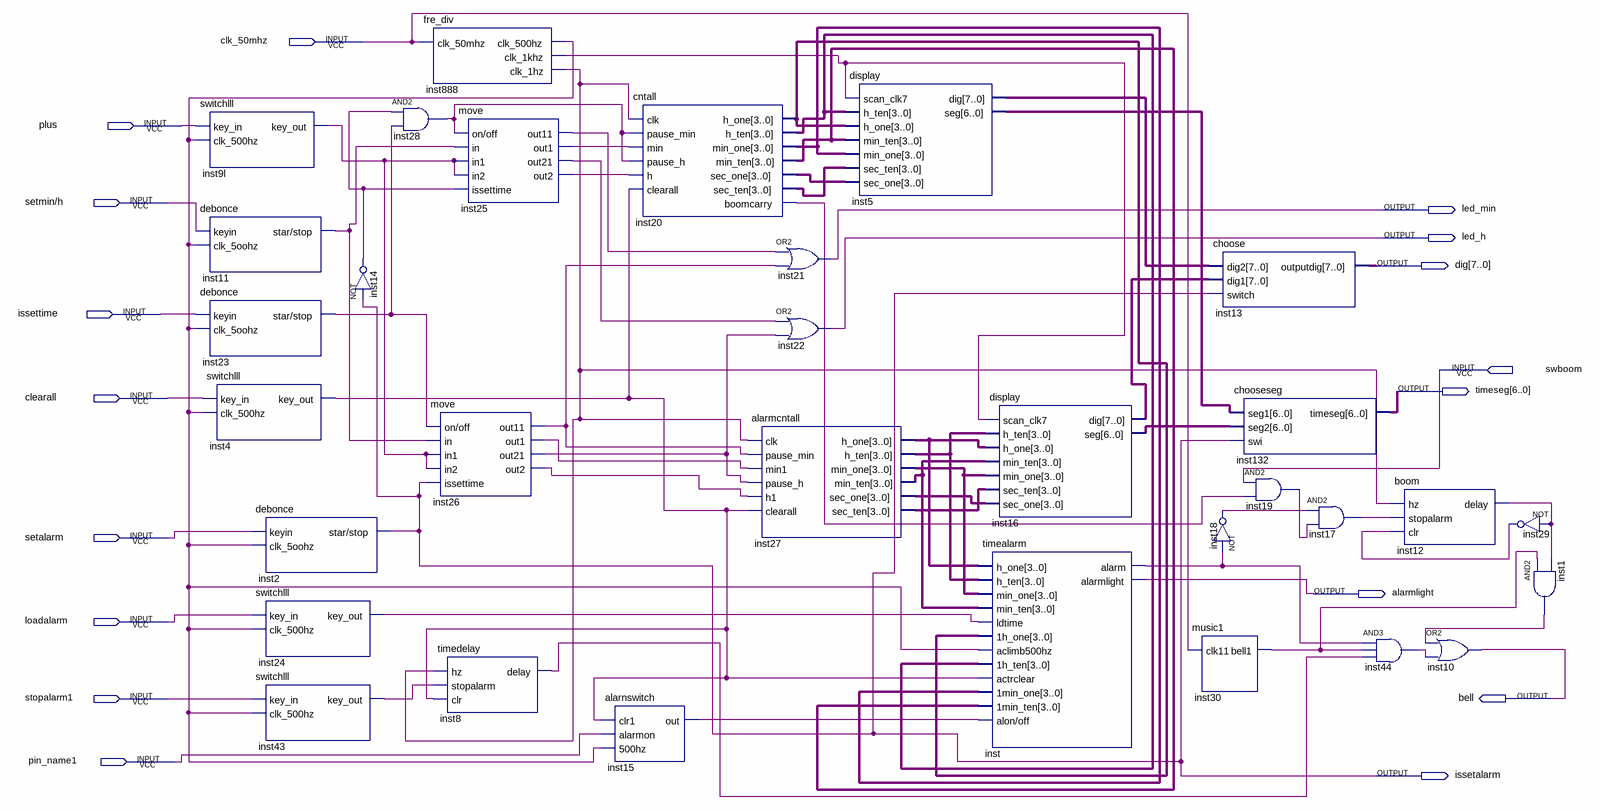
[diagram p0: schematic sheet]
// Quartus schematic clock.bdf as structural Verilog: 32 symbols, 17 pins
module clock (
  input  clk_50mhz,
  input  plus,
  input  \setmin/h ,
  input  issettime,
  input  swboom,
  input  clearall,
  input  setalarm,
  input  loadalarm,
  input  stopalarm1,
  input  pin_name1,
  output led_min,
  output led_h,
  output [7:0] dig,
  output [6:0] timeseg,
  output alarmlight,
  output bell,
  output issetalarm
);

  wire inst1_out, inst4_key_out, inst8_delay, inst9l_key_out, inst11_star_stop, inst12_delay, inst14_out,
       inst15_out, inst17_out, inst18_out, inst19_out, inst20_boomcarry, inst23_star_stop, inst24_key_out,
       inst25_out1, inst25_out2, inst25_out11, inst25_out21, inst26_out1, inst26_out2, inst26_out11,
       inst26_out21, inst28_out, inst29_out, inst30_bell1, inst43_key_out, inst44_out, inst888_clk_1hz,
       inst888_clk_1khz, inst888_clk_500hz, inst_alarm;
  wire [3:0] inst20_h_one, inst20_h_ten, inst20_min_one, inst20_min_ten, inst20_sec_one, inst20_sec_ten,
       inst27_h_one, inst27_h_ten, inst27_min_one, inst27_min_ten, inst27_sec_one, inst27_sec_ten;
  wire [6:0] inst5_seg, inst16_seg;
  wire [7:0] inst5_dig, inst16_dig;

  switchlll inst9l (.key_in(plus), .clk_500hz(inst888_clk_500hz), .key_out(inst9l_key_out));
  debonce inst11 (.keyin(\setmin/h ), .clk_5oohz(inst888_clk_500hz), .\star/stop (inst11_star_stop));
  debonce inst23 (.keyin(issettime), .clk_5oohz(inst888_clk_500hz), .\star/stop (inst23_star_stop));
  switchlll inst4 (.key_in(clearall), .clk_500hz(inst888_clk_500hz), .key_out(inst4_key_out));
  debonce inst2 (.keyin(setalarm), .clk_5oohz(inst888_clk_500hz), .\star/stop (issetalarm));
  switchlll inst24 (.key_in(loadalarm), .clk_500hz(inst888_clk_500hz), .key_out(inst24_key_out));
  switchlll inst43 (.key_in(stopalarm1), .clk_500hz(inst888_clk_500hz), .key_out(inst43_key_out));
  not inst14 (inst14_out, issetalarm);
  and inst28 (inst28_out, inst14_out, inst23_star_stop);
  fre_div inst888 (
    .clk_50mhz(clk_50mhz), .clk_500hz(inst888_clk_500hz), .clk_1khz(inst888_clk_1khz),
    .clk_1hz(inst888_clk_1hz));
  move inst25 (
    .\on/off (inst28_out), .in(inst11_star_stop), .in1(inst9l_key_out), .in2(inst9l_key_out),
    .issettime(inst14_out), .out11(inst25_out11), .out1(inst25_out1), .out21(inst25_out21), .out2(inst25_out2));
  move inst26 (
    .\on/off (inst23_star_stop), .in(inst11_star_stop), .in1(inst9l_key_out), .in2(inst9l_key_out),
    .issettime(issetalarm), .out11(inst26_out11), .out1(inst26_out1), .out21(inst26_out21), .out2(inst26_out2));
  timedelay inst8 (.hz(inst888_clk_1hz), .stopalarm(inst43_key_out), .clr(inst4_key_out), .delay(inst8_delay));
  cntall inst20 (
    .clk(inst888_clk_1hz), .pause_min(inst28_out), .min(inst25_out1), .pause_h(inst28_out), .h(inst25_out2),
    .clearall(inst4_key_out), .h_one(inst20_h_one), .h_ten(inst20_h_ten), .min_one(inst20_min_one),
    .min_ten(inst20_min_ten), .sec_one(inst20_sec_one), .sec_ten(inst20_sec_ten), .boomcarry(inst20_boomcarry));
  alarnswitch inst15 (.clr1(inst4_key_out), .alarmon(pin_name1), .\500hz (inst888_clk_500hz), .out(inst15_out));
  alarmcntall inst27 (
    .clk(inst888_clk_1hz), .pause_min(inst26_out11), .min1(inst26_out1), .pause_h(inst26_out21),
    .h1(inst26_out2), .clearall(inst4_key_out), .h_one(inst27_h_one), .h_ten(inst27_h_ten),
    .min_one(inst27_min_one), .min_ten(inst27_min_ten), .sec_one(inst27_sec_one), .sec_ten(inst27_sec_ten));
  or inst21 (led_min, inst25_out11, inst26_out11);
  or inst22 (led_h, inst25_out21, inst26_out21);
  display inst5 (
    .scan_clk7(inst888_clk_1khz), .h_ten(inst20_h_ten), .h_one(inst20_h_one), .min_ten(inst20_min_ten),
    .min_one(inst20_min_one), .sec_ten(inst20_sec_ten), .sec_one(inst20_sec_one), .dig(inst5_dig),
    .seg(inst5_seg));
  display inst16 (
    .scan_clk7(inst888_clk_1khz), .h_ten(inst27_h_ten), .h_one(inst27_h_one), .min_ten(inst27_min_ten),
    .min_one(inst27_min_one), .sec_ten(inst27_sec_ten), .sec_one(inst27_sec_one), .dig(inst16_dig),
    .seg(inst16_seg));
  timealarm inst (
    .h_one(inst27_h_one), .h_ten(inst27_h_ten), .min_one(inst27_min_one), .min_ten(inst27_min_ten),
    .ldtime(inst24_key_out), .\1h_one (inst20_h_one), .aclimb500hz(inst888_clk_500hz),
    .\1h_ten (inst20_h_ten), .actrclear(inst4_key_out), .\1min_one (inst20_min_one),
    .\1min_ten (inst20_min_ten), .\alon/off (inst15_out), .alarm(inst_alarm), .alarmlight(alarmlight));
  music1 inst30 (.clk11(clk_50mhz), .bell1(inst30_bell1));
  choose inst13 (.dig2(inst5_dig), .dig1(inst16_dig), .switch(issetalarm), .outputdig(dig));
  chooseseg inst132 (.seg1(inst5_seg), .seg2(inst16_seg), .swi(issetalarm), .timeseg(timeseg));
  and inst19 (inst19_out, swboom, inst20_boomcarry);
  not inst18 (inst18_out, inst_alarm);
  and inst17 (inst17_out, inst18_out, inst19_out);
  and inst44 (inst44_out, inst_alarm, inst30_bell1, inst8_delay);
  boom inst12 (.hz(inst888_clk_1hz), .stopalarm(inst17_out), .clr(inst29_out), .delay(inst12_delay));
  or inst10 (bell, inst1_out, inst44_out);
  not inst29 (inst29_out, inst12_delay);
  and inst1 (inst1_out, inst30_bell1, inst12_delay);
endmodule
